# EAGLE schematic BSPD System Schematic (EAGLE 9.6.2)
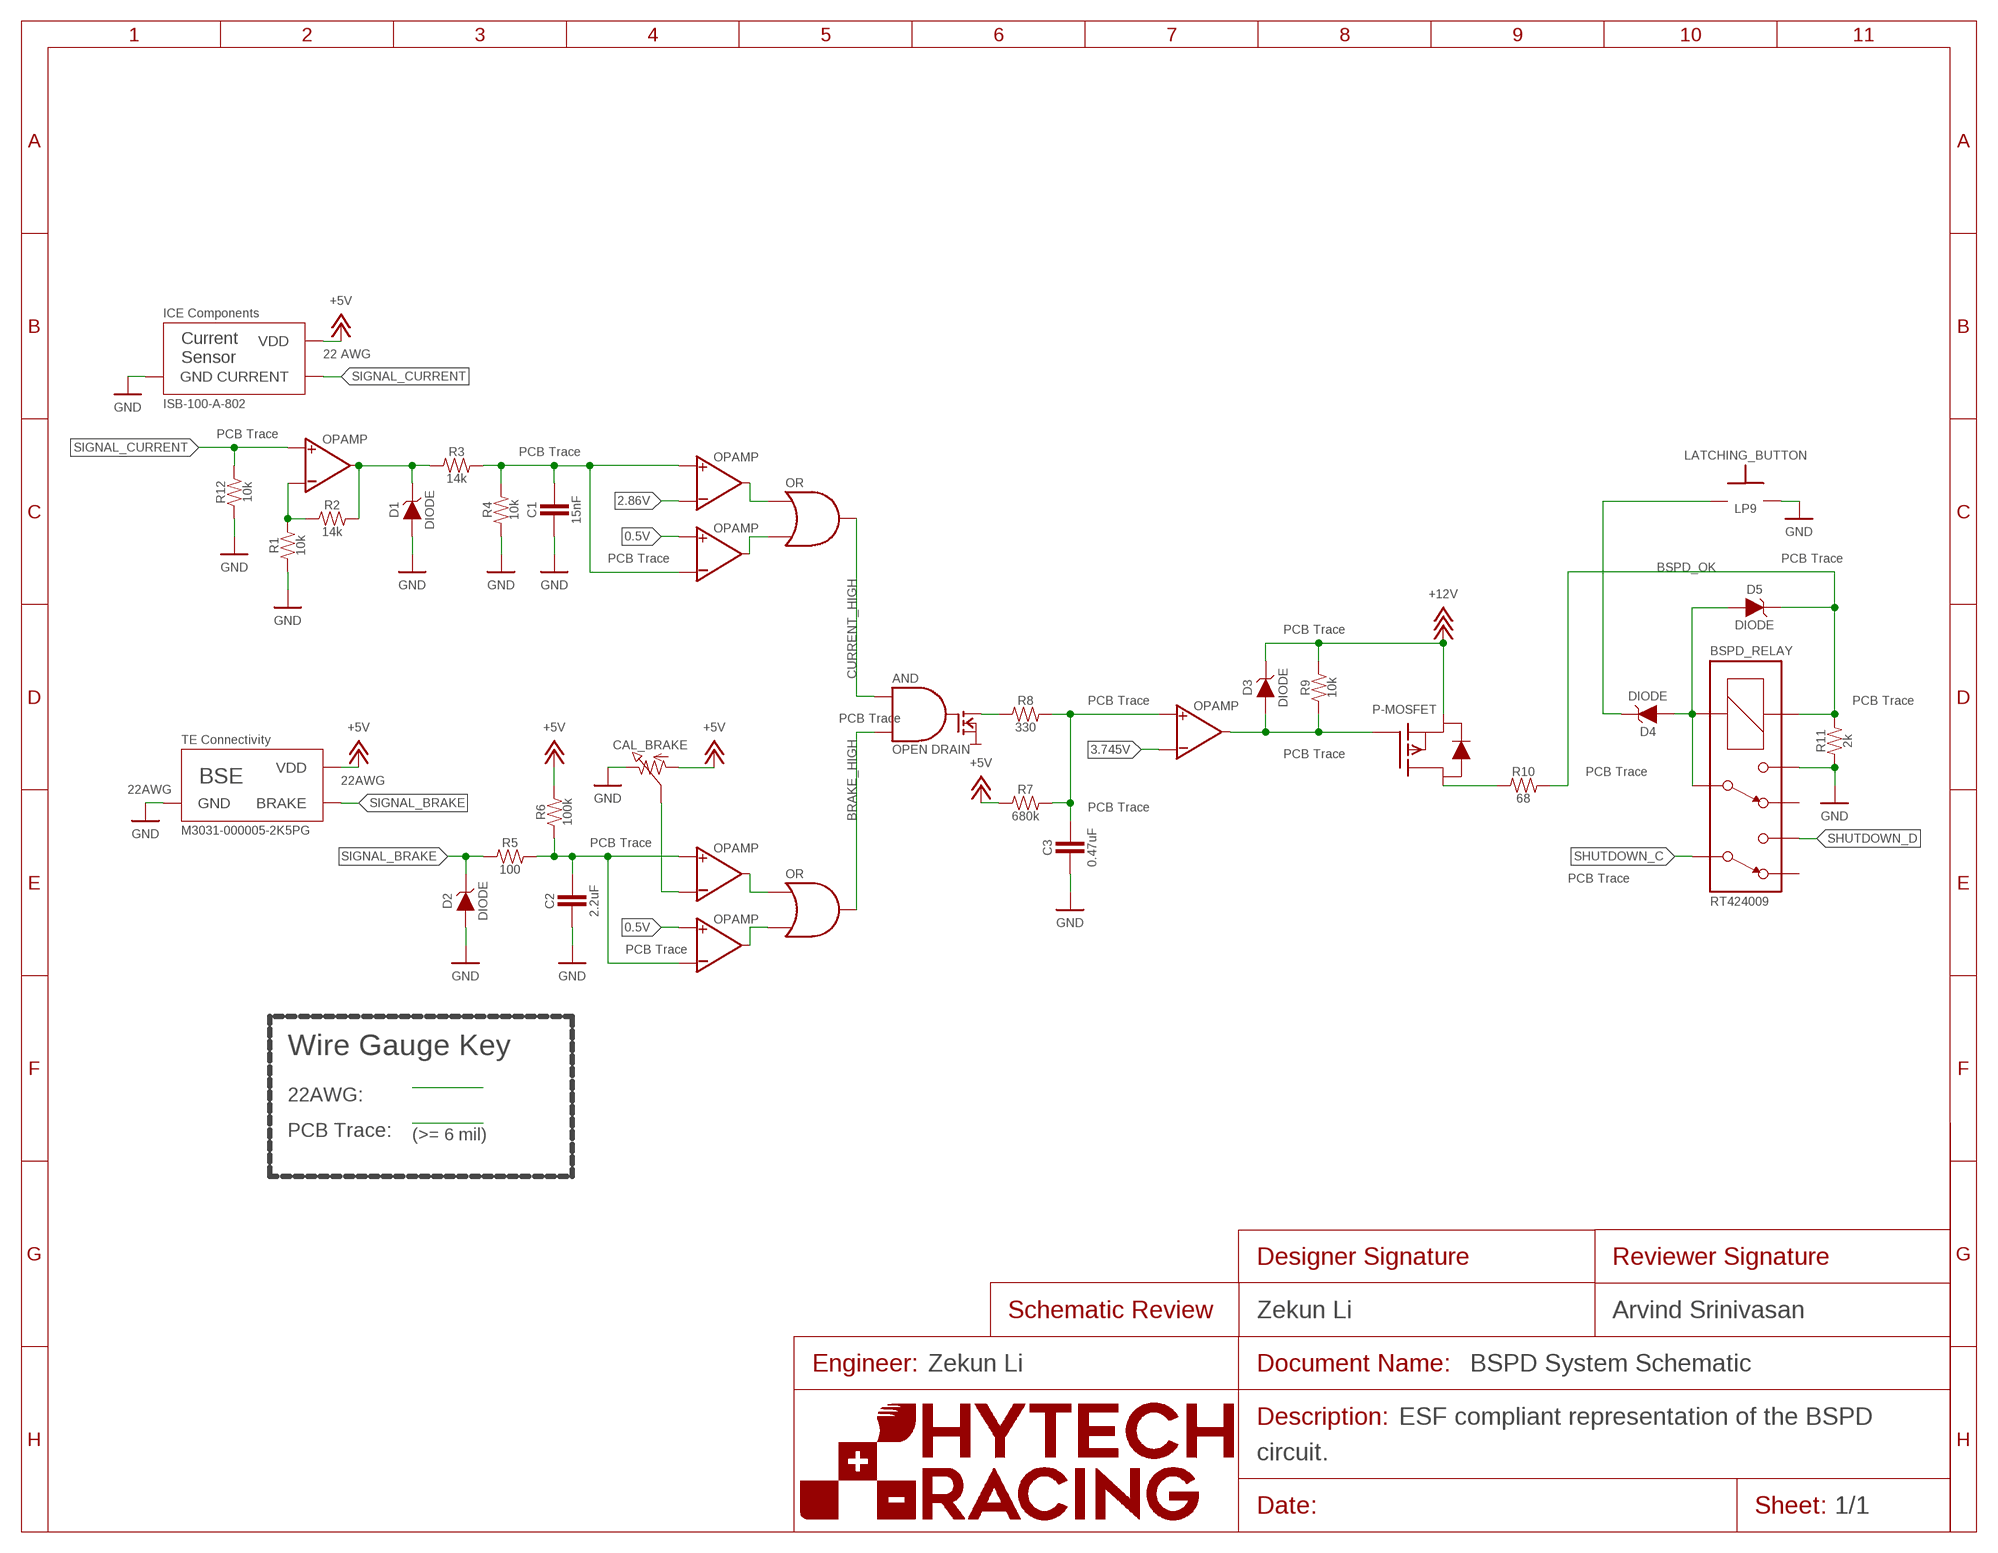
[diagram p0: schematic, sheet 1]
U$5 (FRAME_SCHEMATIC_ONLY): DESCRIPTION_1: ESF compliant representation of the BSPD; DESCRIPTION_2: circuit.; DESIGNER_SCHEMATIC: Zekun Li; ENGINEER: Zekun Li; REVIEWER_SCHEMATIC: Arvind Srinivasan

## Parts
A1  CURRENT_SENSORISB-100-A-802  (no package)
A2  BSEM3031-000005-2K5PG  (no package)
BSPD_RELAY  RELAY_DPDT_RT424009  (no package)
C1  15nF  CAPACITOR  (no package)
C2  2.2uF  CAPACITOR  (no package)
C3  0.47uF  CAPACITOR  (no package)
CAL_BRAKE  RESISTOR_TRIMPOT  (no package)
D1  DIODE  (no package)
D2  DIODE  (no package)
D3  DIODE  (no package)
D4  DIODE  (no package)
D5  DIODE  (no package)
LATCHING_BUTTON  BUTTON_NO_LP9  (no package)
R1  10k  RESISTOR  (no package)
R2  14k  RESISTOR  (no package)
R3  14k  RESISTOR  (no package)
R4  10k  RESISTOR  (no package)
R5  100  RESISTOR  (no package)
R6  100k  RESISTOR  (no package)
R7  680k  RESISTOR  (no package)
R8  330  RESISTOR  (no package)
R9  10k  RESISTOR  (no package)
R10  68  RESISTOR  (no package)
R11  2k  RESISTOR  (no package)
R12  10k  RESISTOR  (no package)
U1  OPAMP  (no package)
U2  OPAMP  (no package)
U3  OPAMP  (no package)
U4  OPAMP  (no package)
U5  OPAMP  (no package)
U6  OPAMP  (no package)
U$1  LOGICGATE_OR  (no package)
U$2  LOGICGATE_OR  (no package)
U$3  LOGICGATE_AND_OPENDRAIN  (no package)
U$4  MOSFET_P-CHANNEL  (no package)

## Nets
0.5V: U2.VIN+ U4.VIN+
2.86V: U1.VIN-
3.745V: U5.VIN-
+5V: A1.VDD A2.VDD CAL_BRAKE.1 R6.2 R7.1
+12V: D3.C R9.2 U$4.S
BRAKE_HIGH: U$2.OUT U$3.IN2
BSPD_OK: BSPD_RELAY.COIL+ D5.C R10.2 R11.2
CURRENT_HIGH: U$1.OUT U$3.IN1
GND: A1.GND A2.GND BSPD_RELAY.4 C1.2 C2.2 C3.2 CAL_BRAKE.2 D1.A D2.A LATCHING_BUTTON.P$2 R1.1 R4.1 R11.1 R12.1
LATCH_BUTTON: D4.C LATCHING_BUTTON.P$1
N$1: C1.1 R3.2 R4.2 U1.VIN+ U2.VIN-
N$2: U2.VOUT U$1.IN2
N$3: U1.VOUT U$1.IN1
N$4: C2.1 R5.2 R6.1 U3.VIN+ U4.VIN-
N$6: CAL_BRAKE.P$1 U3.VIN-
N$7: U3.VOUT U$2.IN1
N$8: U4.VOUT U$2.IN2
N$9: R8.1 U$3.OUT
N$10: C3.1 R7.2 R8.2 U5.VIN+
N$11: D3.A R9.1 U5.VOUT U$4.G
N$12: R10.1 U$4.D
N$14: BSPD_RELAY.3 BSPD_RELAY.COIL- D4.A D5.A
N$15: R1.2 R2.1 U6.VIN-
SHUTDOWN_C: BSPD_RELAY.6
SHUTDOWN_D: BSPD_RELAY.5
SIGNAL_BRAKE: A2.BRAKE D2.C R5.1
SIGNAL_CURRENT: A1.CURRENT D1.C R2.2 R3.1 R12.2 U6.VIN+ U6.VOUT
Unconnected: BSPD_RELAY.2 BSPD_RELAY.7

## Notes on the sheet
- 22 AWG
- PCB Trace
- PCB Trace
- PCB Trace | PCB Trace
- PCB Trace
- PCB Trace | PCB Trace
- PCB Trace
- PCB Trace
- PCB Trace
- 22AWG | 22AWG
- PCB Trace
- PCB Trace
- PCB Trace
- PCB Trace
- Wire Gauge Key
- 22AWG:
- PCB Trace:
- (>= 6 mil)

## Library data of the parts
A1 = HyTechSymbolsTemp:CURRENT_SENSOR: Current sensor ISB-100-A-802 <https://drive.google.com/file/d/1TFe_k71_-CaaeTxBeJvnXcb4MXyxoknx/view>; MANUFACTURER: ICE Components; MPN: ISB-100-A-802
A2 = HyTechSymbolsTemp:BSE: Brake system encoder M3031-000005-2K5PG <https://www.mouser.com/datasheet/2/418/6/ENG_DS_MSP300_B-1130121.pdf>; MANUFACTURER: TE Connectivity; MPN: M3031-000005-2K5PG
BSPD_RELAY = HyTechSymbolsTemp:RELAY_DPDT_?*: Dual pole dual throw relay RT424009 <https://drive.google.com/file/d/12KcB2gZ1-F85lC-w8KP3F9yHGxVaqaUc/view>; MANUFACTURER: TE Connectivity Potter & Brumfield Relays; MPN: RT424009
C1-C3 = HyTechSymbolsTemp:CAPACITOR
CAL_BRAKE = HyTechSymbolsTemp:RESISTOR_TRIMPOT
D1-D5 = HyTechSymbolsTemp:DIODE
LATCHING_BUTTON = HyTechSymbolsTemp:BUTTON_NO_*: Normally open pushbutton OTTO P9 Series Pushbutton Switches <https://www.mouser.com/datasheet/2/603/P9_Sealed_Dome_Pushbuttons_Catalog_Pages-2576938.pdf> OTTO LP9 Series Illuminated Pushbutton Switches <https://www.otto-controls.com/-/media/products/electromechanical-switches/pushbuttonswitches/lp9illuminatedsealedmomentaryactionpushbuttonswitch/LP9-Pushbuttons-Catalog-Pages.ashx>; MANUFACTURER: OTTO; MPN: LP9
R1-R12 = HyTechSymbolsTemp:RESISTOR
U1-U6 = HyTechSymbolsTemp:OPAMP
U$1 U$2 = HyTechSymbolsTemp:LOGICGATE_OR
U$3 = HyTechSymbolsTemp:LOGICGATE_AND_OPENDRAIN
U$4 = HyTechSymbolsTemp:MOSFET_P-CHANNEL